# EAGLE design RAK3172-Breakout (EAGLE 7.7.0)
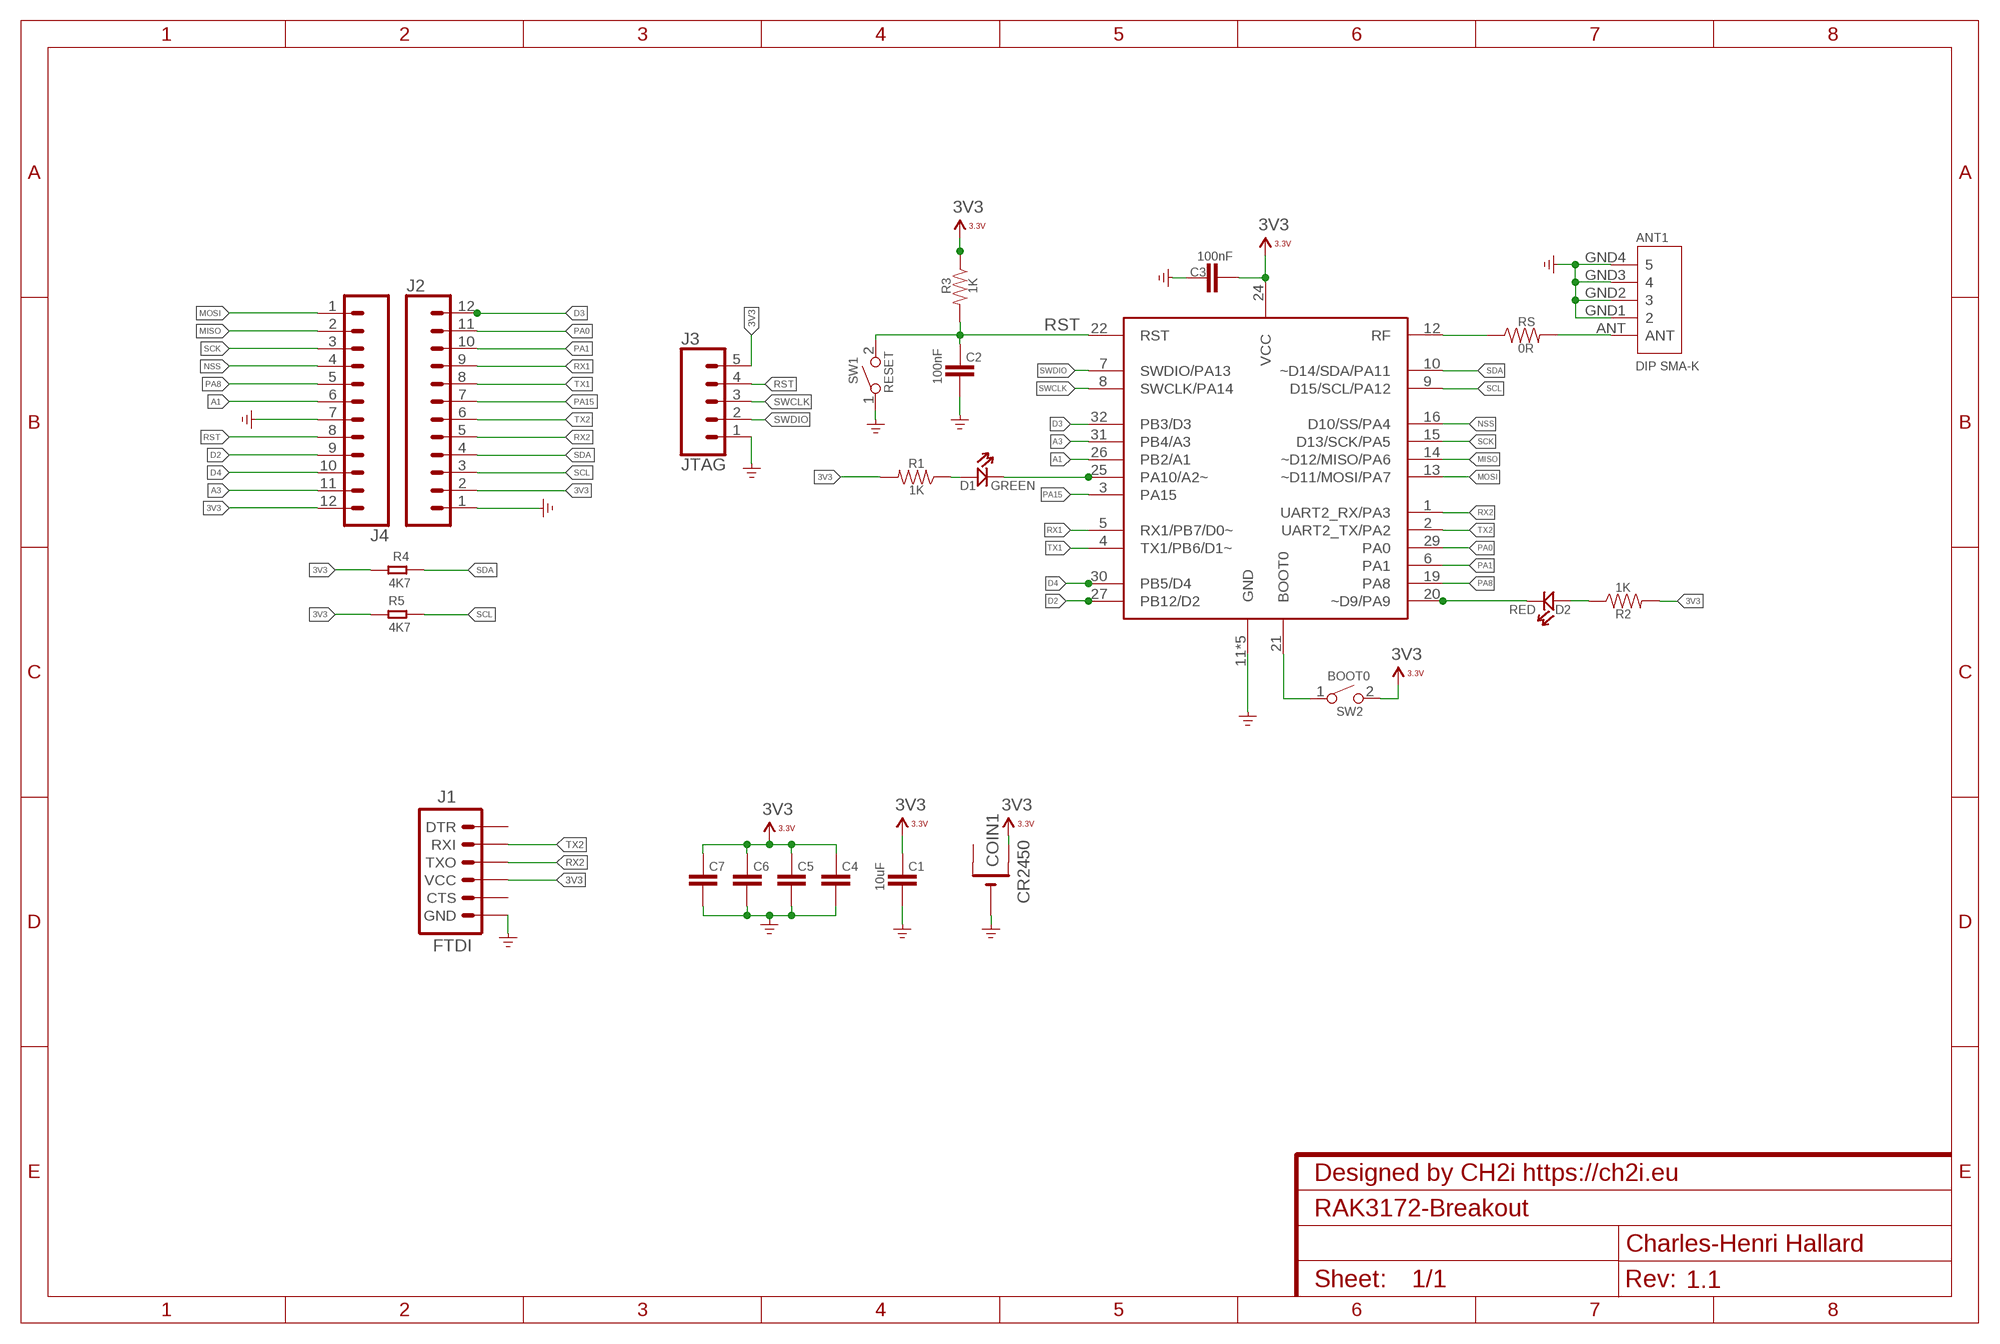
[diagram p0: schematic, sheet 1]
NAME (FRAME-A4L): CNAME: Designed by CH2i https://ch2i.eu; CREVISION: 1.1; DESIGNER: Charles-Henri Hallard

## Parts
ANT1  DIP SMA-K  ANTENNA-SMA-MCX-JE-320160125  [SMA5P-SMD-5.1-6.5X6.5X16.5MM]
C1  10uF  CAP0805-CAP  [0805-CAP]
C2  100nF  CAP0805-CAP  [0805-CAP]
C3  100nF  CAP0805-CAP  [0805-CAP]
C4  100uF  CAP0805-CAP  [0805-CAP]
C5  100uF  CAP0805-CAP  [0805-CAP]
C6  100uF  CAP0805-CAP  [0805-CAP]
C7  100uF  CAP0805-CAP  [0805-CAP]
COIN1  CR2450  CR2450SMD  [CR2450-SMD]
D1  GREEN  LED'0805'  [LED-0805]
D2  RED  LED'0805'  [LED-0805]
J1  FTDI  6_PIN_SERIAL_TARGETSMD  [1X06-SMD_RA_MALE]
J2  CONN_12NO_SILK  [1X12_NO_SILK]
J3  JTAG  CONN_05LOCK  [1X05_LOCK]
J4  CONN_12NO_SILK  [1X12_NO_SILK]
R1  1K  RESISTOR0805-RES  [0805-RES]
R2  1K  RESISTOR0805-RES  [0805-RES]
R3  1K  RESISTOR0805-RES  [0805-RES]
R4  4K7  RES-0805  [R0805]
R5  4K7  RES-0805  [R0805]
RS  0R  RESISTORMATCHINGNETWORK  [0603-MATCHNET]
SW1  RESET  SMD-BUTTON(2P-3.0X2.5X1.2+0.4MM)-B3U-1000P-2P-SMD  [SW2-2.6-3.0X2.5X1.2+0.4MM]
SW2  BOOT0  SMD-BUTTON(2P-3.0X2.5X1.2+0.4MM)-B3U-1000P-2P-SMD  [SW2-2.6-3.0X2.5X1.2+0.4MM]
U$3  RAK3172HF  [RAK3172]

## Nets
3V3: C1.2 C3.2 C4.2 C5.2 C6.2 C7.2 COIN1.+$2(+1) J1.4(VCC) J2.2 J3.5 J4.12 R1.2 R2.2 R3.1 R4.1 R5.1 SW2.2 U$3.24(VCC)
A1: J4.6 U$3.26(PB2/A1)
A3: J4.11 U$3.31(PB4/A3)
D2: J4.9 U$3.27(PB12/D2)
D3: J2.12 U$3.32(PB3/D3)
D4: J4.10 U$3.30(PB5/D4)
GND: ANT1.GND1 ANT1.GND2 ANT1.GND3 ANT1.GND4 C1.1 C2.1 C3.1 C4.1 C5.1 C6.1 C7.1 COIN1.- J1.6(GND) J2.1 J3.1 J4.7 SW1.1 U$3.11(GND) U$3.17(GND) U$3.18(GND) U$3.23(GND) U$3.28(GND) ; supply symbol labelled GND_POWER
GREEN: D1.- U$3.25(PA10/A2~)
MISO: J4.2 U$3.14(~D12/MISO/PA6)
MOSI: J4.1 U$3.13(~D11/MOSI/PA7)
N$2: D1.+ R1.1
N$3: SW2.1 U$3.21(BOOT0)
N$12: D2.+ R2.1
N$13: ANT1.ANT RS.2
NSS: J4.4 U$3.16(D10/SS/PA4)
PA0: J2.11 U$3.29(PA0)
PA1: J2.10 U$3.6(PA1)
PA8: J4.5 U$3.19(PA8)
PA15: J2.7 U$3.3(PA15)
RED: D2.- U$3.20(~D9/PA9)
RF: RS.1 U$3.12(RF)
RST: C2.2 J3.4 J4.8 R3.2 SW1.2 U$3.22(RST)
RX1: J2.9 U$3.5(RX1/PB7/D0~)
RX2: J1.3(TXO) J2.5 U$3.1(UART2_RX/PA3)
SCK: J4.3 U$3.15(D13/SCK/PA5)
SCL: J2.3 R5.2 U$3.9(D15/SCL/PA12)
SDA: J2.4 R4.2 U$3.10(~D14/SDA/PA11)
SWCLK: J3.3 U$3.8(SWCLK/PA14)
SWDIO: J3.2 U$3.7(SWDIO/PA13)
TX1: J2.8 U$3.4(TX1/PB6/D1~)
TX2: J1.2(RXI) J2.6 U$3.2(UART2_TX/PA2)
Unconnected: COIN1.+$1(+) J1.1(DTR) J1.5(CTS)

## Library data of the parts
ANT1 = Connector-new:ANTENNA-SMA-MCX-JE
C1-C7 = _c2h:CAP: Capacitor Standard 0603 ceramic capacitor, and 0.1" leaded capacitor.
COIN1 = _c2h:CR2450
D1 D2 = Discrete-new:LED
J1 = SparkFun-Connectors:6_PIN_SERIAL_TARGET: 6-pin header connection for use with the "FTDI BASIC" pinout - TARGET SIDE. Also known as "Arduino Serial Program Header". It is used to mate with our FTDI Basic serial programmers using the Arduino IDE. Note, this device has "TARGET" in the name. It is intended to be used on a design that contains a target micro-controller that you wish to program. The "sister" device, named "CABLE" is inteneded to be used on a design that usually lives on the end of your USB cable and prvides the converter chip (FTDI232 or FTDI231x) to commnicate serial RX/TX. You can populate with some of these: Break Away Headers - Straight <https://www.sparkfun.com/products/116> (PRT-00116) For reference (or to suit your programming needs) check out these designs: SparkFun FTDI Basic Breakout - 5V <https://www.sparkfun.com/products/9716> (DEV-09716) SparkFun FTDI Basic Breakout - 3.3V <https://www.sparkfun.com/products/9873> (DEV-09873) SparkFun FTDI SmartBasic <https://www.sparkfun.com/products/12935> (DEV-12935) SparkFun Beefy 3 - FTDI Basic Breakout <https://www.sparkfun.com/products/13746> (DEV-13746); PROD_ID: CONN-08971
J2 J4 = SparkFun-Connectors:CONN_12: Multi connection point. Often used as Generic Header-pin footprint for 0.1 inch spaced/style header connections On any of the 0.1 inch spaced packages, you can populate with these: Break Away Headers - Straight <https://www.sparkfun.com/products/116> (PRT-00116) Break Away Male Headers - Right Angle <https://www.sparkfun.com/products/553> (PRT-00553) Female Headers <https://www.sparkfun.com/products/115> (PRT-00115) Break Away Headers - Machine Pin <https://www.sparkfun.com/products/117> (PRT-00117) Break Away Female Headers - Swiss Machine Pin <https://www.sparkfun.com/products/743> (PRT-00743) For SCREWTERMINALS and SPRING TERMINALS visit here: Screw Terimnals on SparkFun.com <https://www.sparkfun.com/search/results?term=Screw+Terminals> (5mm/3.5mm/2.54mm spacing) This device is also useful as a general connection point to wire up your design to another part of your project. Our various solder wires solder well into these plated through hole pads. Hook-Up Wire - Assortment (Stranded, 22 AWG) <https://www.sparkfun.com/products/11375> (PRT-11375) Hook-Up Wire - Assortment (Solid Core, 22 AWG) <https://www.sparkfun.com/products/11367> (PRT-11367) View the entire wire category on our website here <https://www.sparkfun.com/categories/141> Special notes: Molex polarized connector foot print use with SKU : PRT-08231 with associated crimp pins and housings. 1MM SMD Version SKU: PRT-10208 NOTES ON THE VARIANTS LOCK and LOCK_LONGPADS... This footprint was designed to help hold the alignment of a through-hole component (i.e. 6-pin header) while soldering it into place. You may notice that each hole has been shifted either up or down by 0.005 of an inch from it's more standard position (which is a perfectly straight line). This slight alteration caused the pins (the squares in the middle) to touch the edges of the holes. Because they are alternating, it causes a "brace" to hold the component in place. 0.005 has proven to be the perfect amount of "off-center" position when using our standard breakaway headers. Although looks a little odd when you look at the bare footprint, once you have a header in there, the alteration is very hard to notice. Also,if you push a header all the way into place, it is covered up entirely on the bottom side.
J3 = SparkFun-Connectors:CONN_05: Multi connection point. Often used as Generic Header-pin footprint for 0.1 inch spaced/style header connections On any of the 0.1 inch spaced packages, you can populate with these: Break Away Headers - Straight <https://www.sparkfun.com/products/116> (PRT-00116) Break Away Male Headers - Right Angle <https://www.sparkfun.com/products/553> (PRT-00553) Female Headers <https://www.sparkfun.com/products/115> (PRT-00115) Break Away Headers - Machine Pin <https://www.sparkfun.com/products/117> (PRT-00117) Break Away Female Headers - Swiss Machine Pin <https://www.sparkfun.com/products/743> (PRT-00743) For SCREWTERMINALS and SPRING TERMINALS visit here: Screw Terimnals on SparkFun.com <https://www.sparkfun.com/search/results?term=Screw+Terminals> (5mm/3.5mm/2.54mm spacing) This device is also useful as a general connection point to wire up your design to another part of your project. Our various solder wires solder well into these plated through hole pads. Hook-Up Wire - Assortment (Stranded, 22 AWG) <https://www.sparkfun.com/products/11375> (PRT-11375) Hook-Up Wire - Assortment (Solid Core, 22 AWG) <https://www.sparkfun.com/products/11367> (PRT-11367) View the entire wire category on our website here <https://www.sparkfun.com/categories/141> Special notes: Molex polarized connector foot print use with SKU : PRT-08231 with associated crimp pins and housings. 1MM SMD Version SKU: PRT-10208
R1-R3 RS = _c2h:RESISTOR: Resistor Basic schematic elements and footprints for 0603, 1206, and PTH resistors.
R4 R5 = Discrete-new:RES
SW1 SW2 = _c2h:SMD-BUTTON(2P-3.0X2.5X1.2+0.4MM): 311020047; MPN: B3U-1000P-2P-SMD; VALUE: B3U-1000P-2P-SMD
U$3 = RAK3172:RAK3172: RAK4260 LoRaWAN module from RAKwireless.

## Board
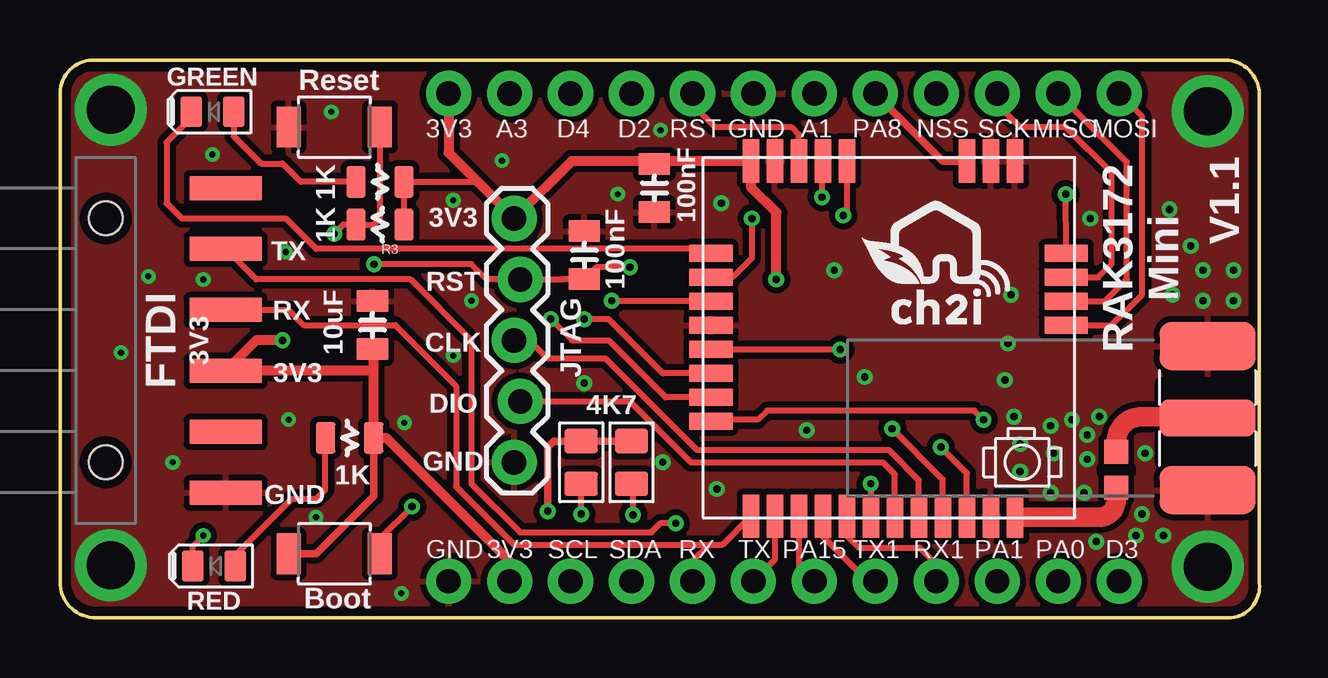
[diagram p1: board, top side]
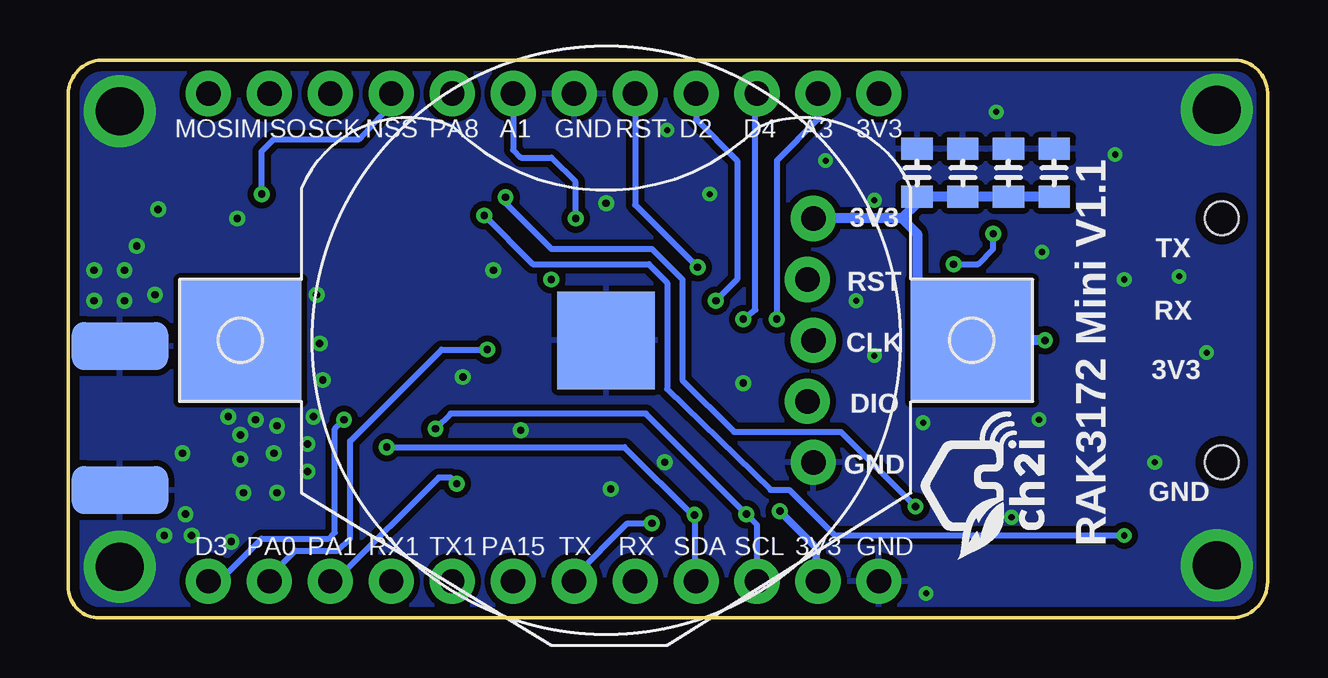
[diagram p2: board, bottom side, seen from below]

Size 49.98 x 23.24 mm. Coordinates in mm from the lower left corner, seen from the top.
Outline: 0,1.49 0,21.76 arc-90 1.35,23.24 48.58,23.24 arc-90 49.97,21.72 49.97,1.43 arc-90 48.8,0 1.5,0 arc-90 0,1.49
Copper layers (1*16): Top 0.0356mm / dielectric 1.5011mm / Bottom 0.0356mm
Design rules "oshpark-2layer *": minimum track width 6mil, minimum drill 10mil, track to track 6mil, track to pad 6mil, pad to pad 6mil, via to via 6mil, smd to smd 6mil, copper to edge 15mil, drill to drill 6mil, minimum pad ring 7mil, minimum via ring 7mil, stop-mask expansion 2.5mil, vias tented up to drill 29mil, thermal gap 10mil
tRestrict: area 45.8,6.5 to 49.5,9.8

### Footprints (pad centres in the part's own frame; a part is rotated, then mirrored left to right if it is on the bottom)
SMA5P-SMD-5.1-6.5X6.5X16.5MM = smd 4 x 1.524: ANT 0,0 | smd 4 x 2: GND1 0,3; GND2 0,-3 | smd 4 x 2 bottom: GND3 0,3; GND4 0,-3
0805-CAP = smd 0.902 x 1.3: 1 -1,0; 2 1,0
CR2450-SMD = smd 5.08 x 5.08: +$1 -15.24,0; +$2 15.24,0 | smd 4.064 x 4.064: - 0,0
LED-0805 = smd 0.889 x 1.27: + 0.889,0; - -0.889,0
1X06-SMD_RA_MALE = smd 1 x 3: 1 -6.35,5; 2 -3.81,5; 3 -1.27,5; 4 1.27,5; 5 3.81,5; 6 6.35,5 | hole 1.4: -5.08,0; 5.08,0
1X12_NO_SILK = drill 1.016 pad 1.88: 1 0,0; 2 2.54,0; 3 5.08,0; 4 7.62,0; 5 10.16,0; 6 12.7,0; 7 15.24,0; 8 17.78,0; 9 20.32,0; 10 22.86,0; 11 25.4,0; 12 27.94,0
1X05_LOCK = drill 1.016 pad 1.88: 1 0,0.127; 2 2.54,-0.127; 3 5.08,0.127; 4 7.62,-0.127; 5 10.16,0.127
0805-RES = smd 0.8 x 1.3: 1 -1,0; 2 1,0
R0805 = smd 1.016 x 1.397: 1 -0.889,0; 2 0.889,0
0603-MATCHNET = smd 1 x 1: 1 -0.736,0; 2 0.748,0
SW2-2.6-3.0X2.5X1.2+0.4MM = smd 1 x 1.7: 1 -1.9,0; 2 1.9,0
RAK3172 = smd 0.7 x 1.8: 1 13.5,14.945; 2 12.5,14.945; 3 11.5,14.945; 4 10.5,14.945; 5 9.5,14.945; 6 8.5,14.945; 7 7.5,14.945; 8 6.5,14.945; 9 5.5,14.945; 10 4.5,14.945; 11 3.5,14.945; 12 2.5,14.945; 17 2.5,0.145; 18 3.5,0.145; 19 4.5,0.145; 20 9.5,0.145; 21 10.5,0.145; 22 11.5,0.145; 23 12.5,0.145; 24 13.5,0.145 | smd 1.8 x 0.7: 13 0.365,6.99; 14 0.365,5.99; 15 0.365,4.99; 16 0.365,3.99; 25 15.165,3.99; 26 15.165,4.99; 27 15.165,5.99; 28 15.165,6.99; 29 15.165,7.99; 30 15.165,8.99; 31 15.165,9.99; 32 15.165,10.99

### Placement (x,y rotation side)
ANT1  47.82,8.32 180 top
C1  13.02,12.19 270 top
C2  21.84,15.11 270 top
C3  24.77,17.91 90 top
C4  14.61,18.54 270 bottom
C5  12.7,18.54 270 bottom
C6  10.79,18.54 270 bottom
C7  8.89,18.54 270 bottom
COIN1  27.56,11.56 0 bottom
D1  6.35,21.08 0 top
D2  6.41,2.16 0 top
J1  1.91,11.56 270 top
J2  16.19,1.52 0 top
J3  19.05,6.48 90 top
J4  44.13,21.84 180 top
R1  13.34,18.16 0 top
R2  12.06,7.49 0 top
R3  13.34,16.38 180 top
R4  23.81,6.48 270 top
R5  21.72,6.48 270 top
RS  44.01,6.16 90 top
SW1  11.43,20.45 0 top
SW2  11.43,2.67 180 top
U$1  [LOGO_C2I_015]  33.4,12.19 0 top
U$2  [LOGO_C2I_015]  9.27,2.41 90 bottom
U$3  42.29,19.18 180 top

### Tracks (layer width: path | path; a pad name or v marks a point on that pad's centre or on a via)
3V3  (via drill 0.3)
  Top 0.254: 17.4,18.16 R1.2 R3.1 | C3.2 24.77,19.03
  Top 0.305: R4.1 R5.1 20.57,7.37 20.32,7.11 v20.32,4.45 | SW2.2 10.67,2.67 13.06,5.06 R2.2
  Top 0.406: 12.95,10.29 13.02,10.35 13.02,10.33 13.06,10.29 | J2.2 18.73,2.35 13.59,7.49 R2.2 13.06,10.29 | 13.06,10.29 13.06,11.14 C1.2 | J4.12 16.19,19.37 17.4,18.16 J3.5 21.32,19.03 24.77,19.03 U$3.24 28.79,17.95 29.84,16.89 v29.84,14.1 | 13.06,10.29 12.95,10.29 | 12.95,10.29 J1.4 8.18,11.56 v9.27,11.56
  Bottom 0.305: v20.32,4.45 18.8,2.92 18.8,1.59 J2.2
  Bottom 0.406: 18.92,16.76 J3.5 15.24,16.64 | 15.24,16.64 14.61,16 14.61,13.84 COIN1.+$2 v9.27,11.56 | C7.2 C6.2 C5.2 C4.2 14.61,17.27 15.24,16.64
A1  (via drill 0.3)
  Top 0.254: v28.83,16.64 28.83,14.99 28.07,14.22 27.16,14.22 U$3.26
  Bottom 0.254: J4.6 31.43,19.49 31.11,19.18 29.84,19.18 28.83,18.16 v28.83,16.64
A3  (via drill 0.3)
  Top 0.254: v20.45,12.45 21.34,11.56 22.86,11.56 25.23,9.19 U$3.31
  Bottom 0.254: J4.11 18.73,20.76 20.45,19.05 v20.45,12.45
D2  (via drill 0.3)
  Top 0.254: v22.99,13.21 27.11,13.21 U$3.27
  Bottom 0.254: J4.9 23.81,20.76 22.1,19.05 22.1,14.1 v22.99,13.21
D3  (via drill 0.3)
  Top 0.254: v38.48,8.25 38.1,8.64 29.46,8.64 29.08,8.25 27.19,8.25 U$3.32
  Bottom 0.254: J2.12 43.69,1.52 41.91,3.3 39.12,3.3 38.86,3.56 38.86,7.87 v38.48,8.25
D4  (via drill 0.3)
  Top 0.254: U$3.30 25.12,10.19 22.86,12.45 v21.84,12.45
  Bottom 0.254: v21.84,12.45 21.34,12.83 21.34,21.78 J4.10
GND  (via drill 0.25 pad 0.51, 0.3, 2 pad 3)
  other vias: 2.11,21.17 2.11,2.18 16.38,17.4 14.22,1.02 4.7,6.48 2.54,11.05 3.68,14.22 47.83,21.1 47.83,2.12 18.41,19.05 17.14,13.21 14.35,8.13 23.24,17.65 46.23,17.02 43.31,8.38 42.8,7.62 42.8,6.6 42.67,5.21 41.27,5.21 40.01,6.1 40.01,7.24 41.4,6.86 41.27,8 45.21,6.86 45.09,4.32 44.83,3.43 43.18,3.17 45.97,3.43 42.16,8.25 39.62,13.46 42.93,16.64 27.37,5.37 10.67,4.19 33.53,10.03 32.26,14.48 9.53,8.25 11.3,21.08 5.97,14.1 48.9,13.21 47.62,13.21 46.35,13.46 47.12,15.49 47.62,14.48 39.75,8.38 39.37,9.91 39.5,11.43 6.35,19.3 21.84,9.78 25.11,6.48 31.11,7.81 48.9,14.48 25.02,20.32 27.56,17.27 16.38,10.92 9.4,15.24
  pour Bottom (isolate 0.254): -1.27,24.26 50.16,24.26 50.16,-1.14 -1.27,-1.14
  pour Top (isolate 0.254, rank 3): -0.64,23.62 50.16,23.62 50.16,-0.51 -0.64,-0.51
GREEN
  Top 0.254: D1.- 5.46,20.83 4.45,19.81 4.45,17.27 5.08,16.64 9.4,16.64 10.67,15.37 26.29,15.37 26.54,15.11 27.05,15.11 U$3.25 27.07,15.24
MISO
  Top 0.254: U$3.14 43.54,13.19 44.45,14.1 44.45,18.99 J4.2
MOSI
  Top 0.254: U$3.13 43.81,12.19 45.09,13.46 45.09,20.89 J4.1
N$2
  Top 0.254: R1.1 10.03,18.16 9.27,18.92 8.38,18.92 7.24,20.07 D1.+
N$3  (via drill 0.3)
  Top 0.254: 31.79,18.84 U$3.21 31.75,18.99 v31.75,17.53 | SW2.1 13.33,3.3 v14.67,4.64
  Bottom 0.254: v31.75,17.53 31.75,17.27 29.84,15.37 25.65,15.37 24.38,14.1 24.38,9.91 22.23,7.75 17.78,7.75 v14.67,4.64
N$12
  Top 0.254: D2.+ 7.3,2.6 9.65,4.95 10.67,4.95 11.05,5.33 11.05,7.48 R2.1
N$13
  Top 0.813: RS.2 44.01,7.3 arc-90 45.09,8.38 47.62,8.38 arc-90 ANT1.ANT
NSS  (via drill 0.3)
  Top 0.254: 41.93,15.38 v41.91,17.65
  Top 0.305: U$3.16 41.93,15.38
  Bottom 0.254: v41.91,17.65 41.91,19.43 41.4,19.94 37.85,19.94 36.51,21.4 J4.4
PA0  (via drill 0.3)
  Top 0.254: v32.51,11.18 U$3.29
  Bottom 0.254: J2.11 41.59,1.71 40.51,2.79 38.73,2.79 38.23,3.3 38.23,7.37 34.42,11.18 v32.51,11.18
PA1  (via drill 0.3)
  Top 0.254: v33.78,5.59 U$3.6
  Bottom 0.254: v33.78,5.59 34.04,5.84 34.54,5.84 38.67,1.71 39.05,1.71 J2.10
PA8
  Top 0.305: U$3.19 36.78,19.03 J4.5
PA15
  Top 0.254: U$3.3 30.79,2.17 J2.7
RED  (via drill 0.25 pad 0.51, 0.3)
  Top 0.203: D2.- 5.52,1.84
  Top 0.254: D2.- 5.52,2.99 v5.97,3.43 | U$3.20 32.79,16.92 v32.64,16.76
  Bottom 0.254: v5.97,3.43 18.03,3.43 19.94,5.33 20.7,5.33 25.02,9.52 25.02,13.97 25.78,14.73 30.61,14.73 v32.64,16.76
RF
  Top 0.406: 40.13,4.19 39.83,4.19 arc-90 U$3.12
  Top 0.813: RS.1 44.01,4.89 arc-90 43.31,4.19 40.13,4.19
RST  (via drill 0.3)
  Top 0.254: U$3.22 30.79,20.14 30.48,20.45 27.3,20.45 26.35,21.4 J4.8 | v13.08,14.73 17.14,14.73 17.78,14.1 J3.4 20.95,14.1 20.97,14.11 C2.2 | SW1.2 13.33,17.28 13.34,17.27 13.34,16.64 13.08,16.38 R3.2 11.81,16.38 v11.43,16 | 22.08,14.35 C2.2 | v23.75,14.6 22.34,14.6 C2.2
  Bottom 0.254: J4.8 26.35,17.21 v23.75,14.6 | v13.08,14.73 12.06,14.73 11.43,15.37 v11.43,16
RX1
  Top 0.254: U$3.5 32.79,3.4 33.27,2.92 35.81,2.92 36.45,2.29 36.45,1.59 J2.9
RX2
  Top 0.254: 28.57,4.45 U$3.1 27.61,3.05 27.05,3.05 | J1.3 9.53,12.83 10.16,12.19 13.97,12.19 16.51,9.65 16.51,5.46 18.92,3.05 27.05,3.05 | J2.5 26.35,2.35 27.05,3.05
SCK
  Top 0.254: U$3.15 43.27,14.19 43.81,14.73 43.81,18.54 41.91,20.45 40.01,20.45 39.05,21.4 J4.3
SCL  (via drill 0.3)
  Top 0.254: U$3.9 36.79,5.75 v34.67,7.87 | v21.72,4.32 R5.2
  Bottom 0.254: J2.3 21.27,3.87 v21.72,4.32 25.91,8.51 34.04,8.51 v34.67,7.87
SDA  (via drill 0.3)
  Top 0.254: U$3.10 37.79,6.02 v36.7,7.11 | v23.88,4.29 23.88,5.53 R4.2
  Bottom 0.254: v36.7,7.11 26.8,7.11 23.88,4.19 | 23.88,4.19 23.88,1.59 J2.4 | v23.88,4.29 23.88,4.19
SWCLK
  Top 0.254: U$3.8 35.79,5.74 34.54,6.99 26.54,6.99 22.73,10.79 20.32,10.79 19.56,11.56 J3.3
SWDIO
  Top 0.254: J3.2 23.75,9.02 26.29,6.48 34.29,6.48 34.79,5.98 U$3.7
TX1
  Top 0.254: U$3.4 31.79,3.39 33.66,1.52 J2.8
TX2  (via drill 0.3)
  Top 0.254: 29.84,4.29 U$3.2 29.79,2.42 J2.6 | J1.2 8.18,14.1 14.61,14.1 17.14,11.56 17.14,5.59 19.18,3.56 24.64,3.56 25.02,3.94 v25.65,3.94
  Bottom 0.254: J2.6 28.89,1.71 26.67,3.94 v25.65,3.94

### Text on the board
tPlace: V1.1 | RAK3172 | Mini
bPlace: RAK3172 Mini V1.1
tNames: Reset | 3V3 | A3 | D4 | D2 | RST | GND | A1 | PA8 | NSS | SCK | MISO | MOSI | 3V3 | TX | RST | RX | 3V3 | CLK | JTAG | 3V3 | DIO | GND | GND | GND | 3V3 | SCL | SDA | RX | TX | PA15 | TX1 | RX1 | PA1 | PA0 | D3 | Boot
bNames: 3V3 | A3 | D4 | D2 | RST | GND | A1 | PA8 | NSS | SCK | MISO | MOSI | 3V3 | TX | RST | RX | CLK | 3V3 | DIO | GND | GND | GND | 3V3 | SCL | SDA | RX | TX | PA15 | TX1 | RX1 | PA1 | PA0 | D3
tTest: U1